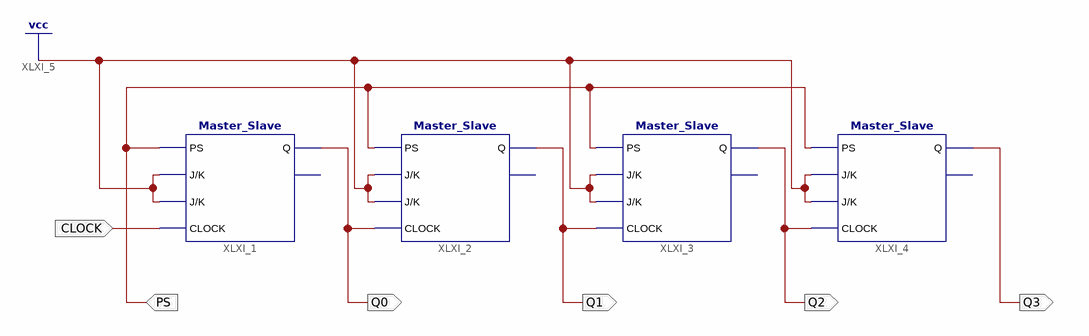
[diagram p0: schematic sheet 1]
// Xilinx ISE schematic Four_Bit_UP_Counter.sch (artix7) as structural Verilog: 4 symbols, 6 ports
module Four_Bit_UP_Counter (
  input  PS,
  input  CLOCK,
  output Q0,
  output Q1,
  output Q2,
  output Q3
);

  Master_Slave XLXI_4 (.CLOCK(Q2), .J(1'b1), .K(1'b1), .PS(PS), .Q(Q3));  // open: Qb
  Master_Slave XLXI_1 (.CLOCK(CLOCK), .J(1'b1), .K(1'b1), .PS(PS), .Q(Q0));  // open: Qb
  Master_Slave XLXI_2 (.CLOCK(Q0), .J(1'b1), .K(1'b1), .PS(PS), .Q(Q1));  // open: Qb
  Master_Slave XLXI_3 (.CLOCK(Q1), .J(1'b1), .K(1'b1), .PS(PS), .Q(Q2));  // open: Qb
endmodule
